# EAGLE schematic Shield_x (EAGLE 9.6.0)
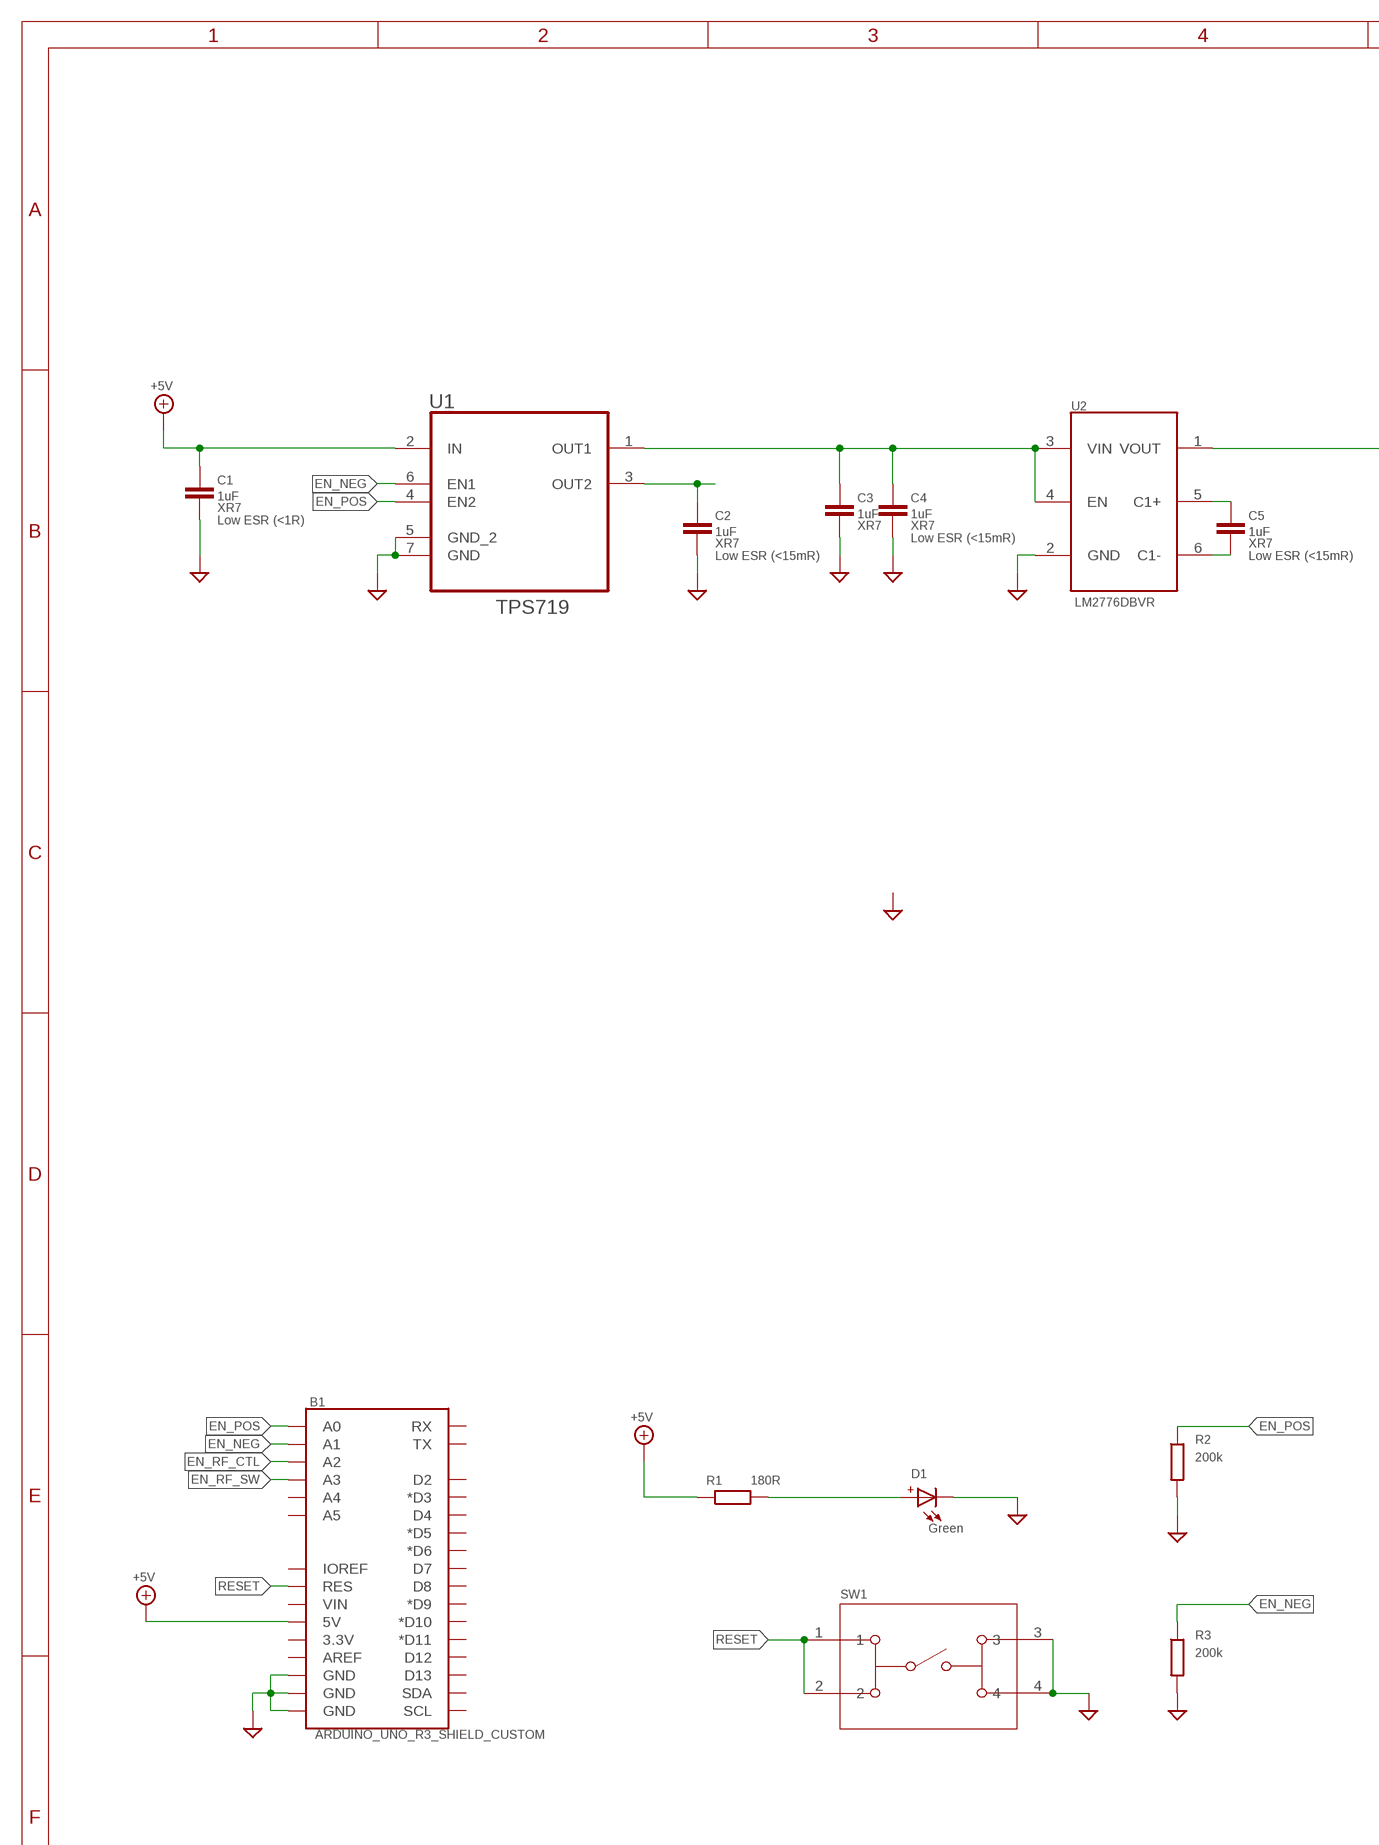
[diagram p0: schematic, sheet 1, part 1 of 2]
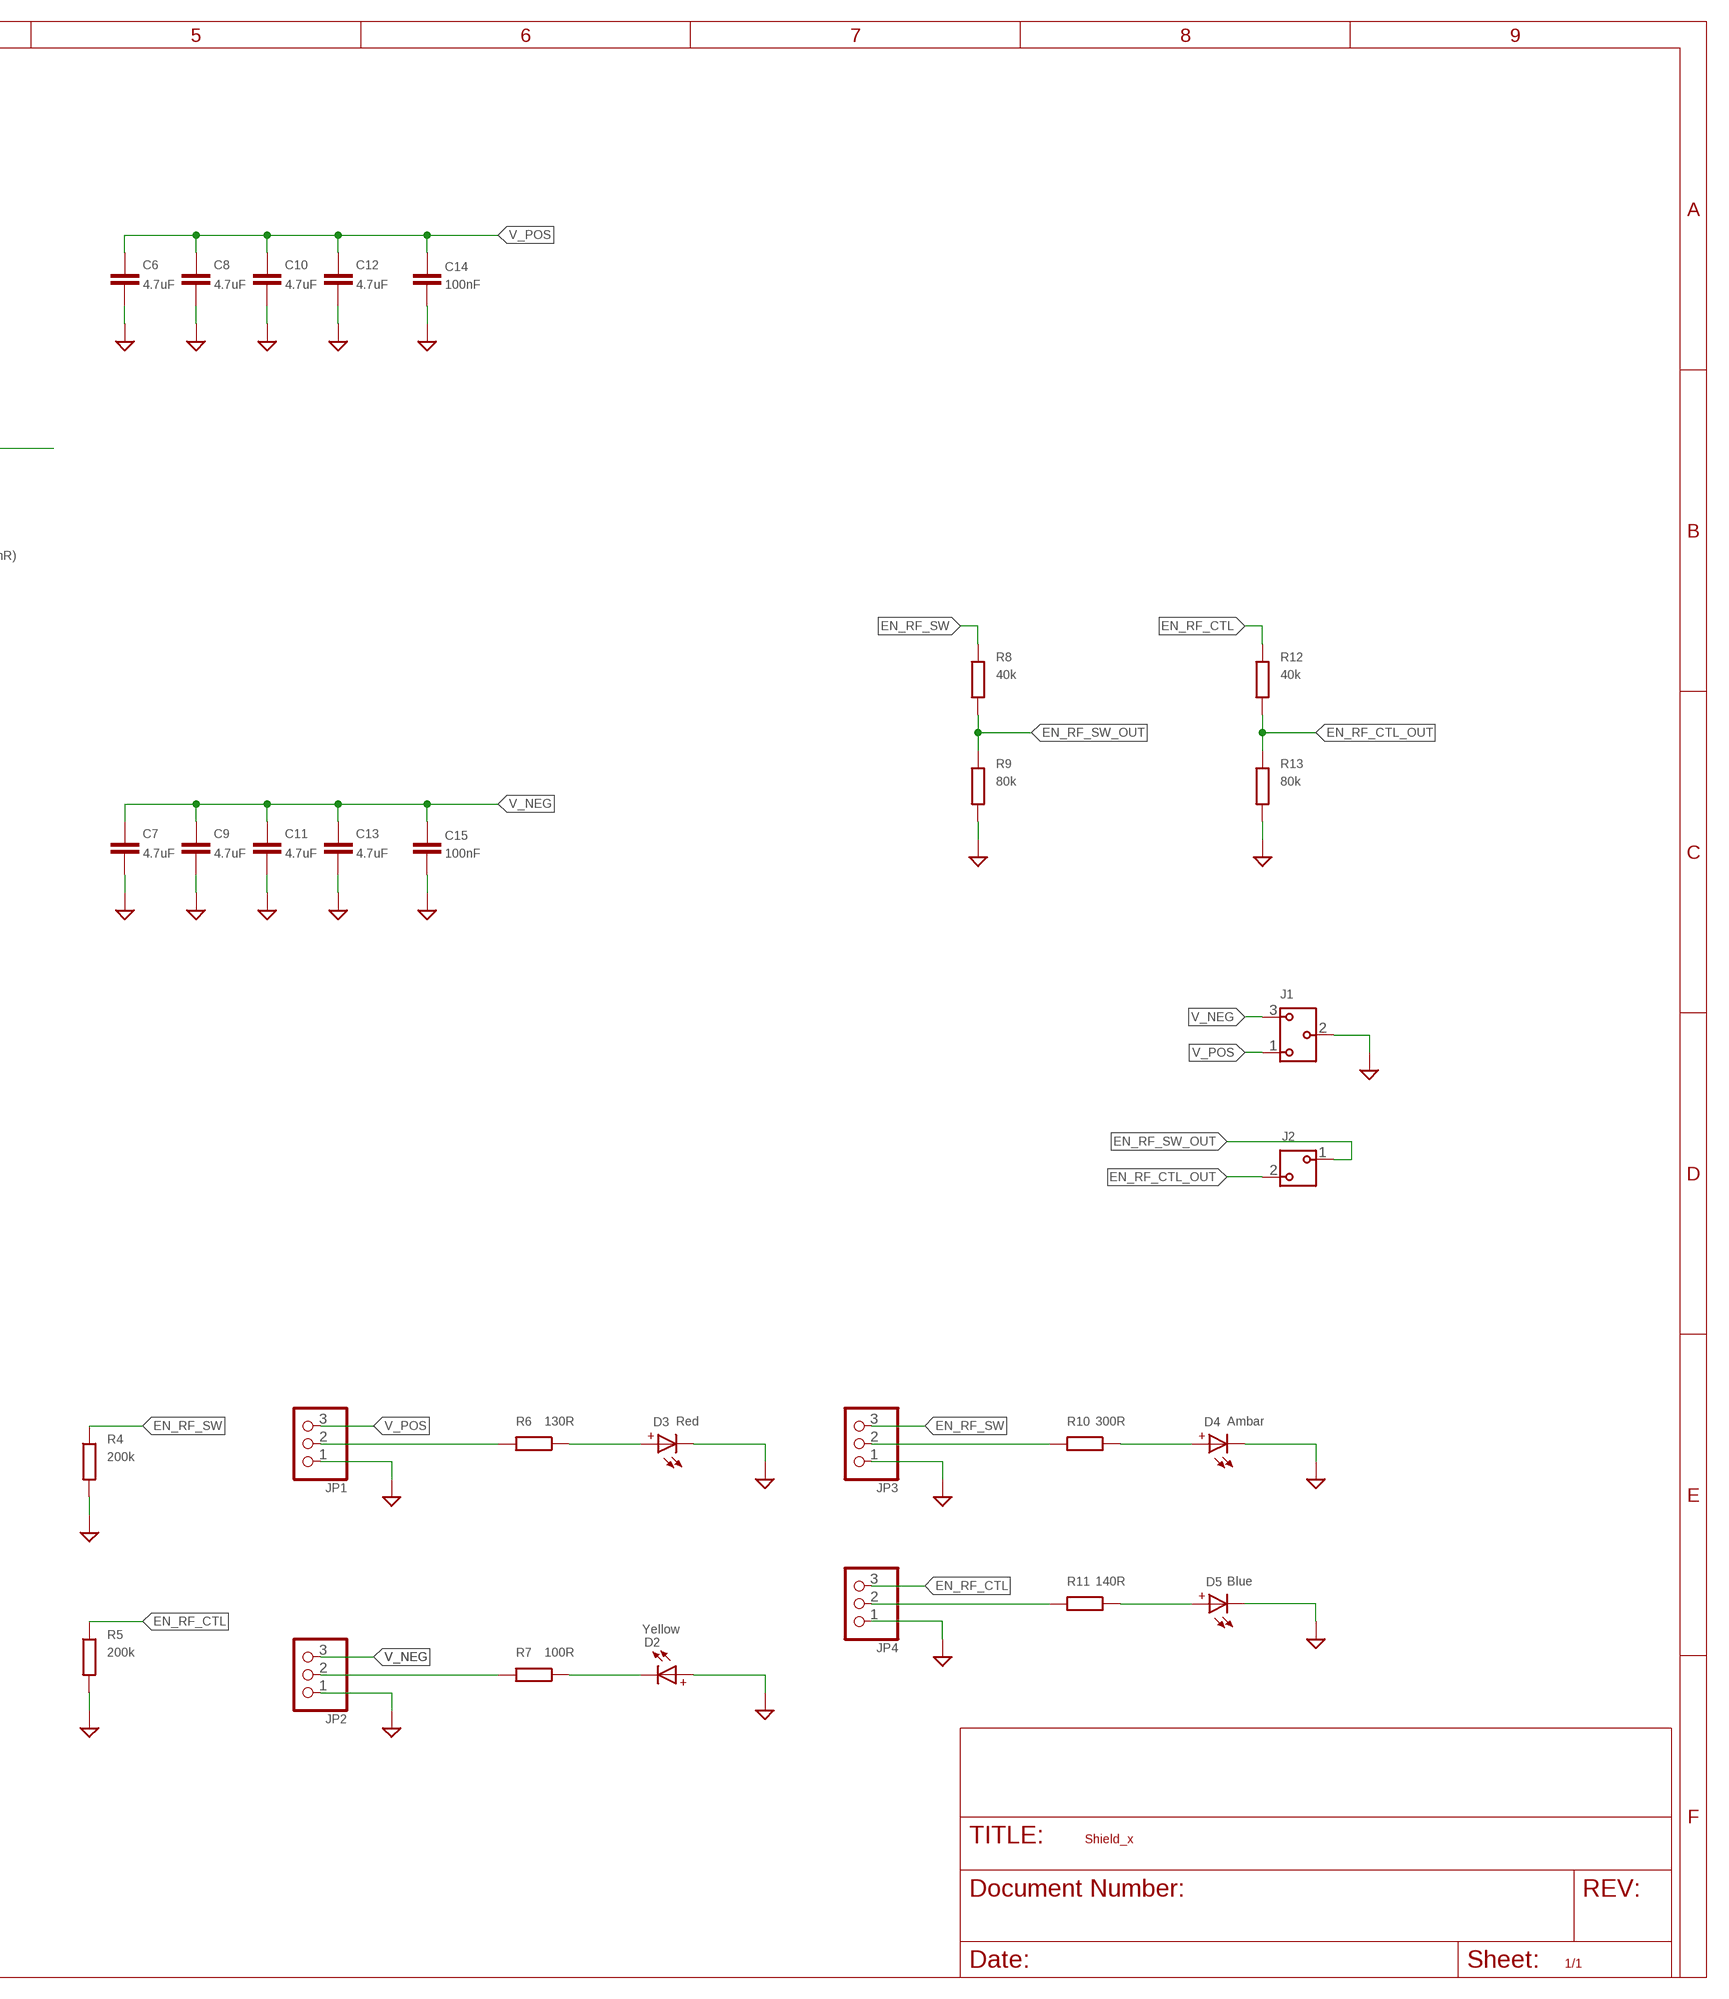
[diagram p1: schematic, sheet 1, part 2 of 2]

## Parts
B1  ARDUINO_UNO_R3_SHIELD_CUSTOM  [UNO_R3_SHIELD_NO_PROG]
C1  1uF  C-EUC0402  [C0402]
C2  1uF  C-EUC0402  [C0402]
C3  1uF  C-EUC0402  [C0402]
C4  1uF  C-EUC0402  [C0402]
C5  1uF  C-EUC0402  [C0402]
C6  4.7uF  C-EUC1206  [C1206]
C7  4.7uF  C-EUC1206  [C1206]
C8  4.7uF  C-EUC1206  [C1206]
C9  4.7uF  C-EUC1206  [C1206]
C10  4.7uF  C-EUC1206  [C1206]
C11  4.7uF  C-EUC1206  [C1206]
C12  4.7uF  C-EUC1206  [C1206]
C13  4.7uF  C-EUC1206  [C1206]
C14  100nF  C-EUC0603  [C0603]
C15  100nF  C-EUC0603  [C0603]
D1  WL-SMCW-150080GS75000  [WL-SMCW_0805]
D2  WL-SMCW-150080YS75000  [WL-SMCW_0805]
D3  WL-SMCW-150080RS75000  [WL-SMCW_0805]
D4  WL-SMCW_150080AS75000  [WL-SMCW_0805]
D5  WL-SMCW-150080BS75000  [WL-SMCW_0805]
J1  691412320003  [691412320003]
J2  691412320002  [691412320002]
JP1  PINHD-1X3  [1X03]
JP2  PINHD-1X3  [1X03]
JP3  PINHD-1X3  [1X03]
JP4  PINHD-1X3  [1X03]
R1  180R  R-EU_R0603  [R0603]
R2  200k  R-EU_R0603  [R0603]
R3  200k  R-EU_R0603  [R0603]
R4  200k  R-EU_R0603  [R0603]
R5  200k  R-EU_R0603  [R0603]
R6  130R  R-EU_R0603  [R0603]
R7  100R  R-EU_R0603  [R0603]
R8  40k  R-EU_R0603  [R0603]
R9  80k  R-EU_R0603  [R0603]
R10  300R  R-EU_R0603  [R0603]
R11  140R  R-EU_R0603  [R0603]
R12  40k  R-EU_R0603  [R0603]
R13  80k  R-EU_R0603  [R0603]
SW1  1825910-6  [SW4_1825910-B]
U1  TPS719  [SON6_5P200X200X80-7N]
U2  LM2776DBVR  [TEXAS_SOT23-6]

## Nets
+5V: B1.5V C1.1 R1.1 U1.2(IN)
EN_NEG: B1.A1 R3.1 U1.6(EN1)
EN_POS: B1.A0 R2.1 U1.4(EN2)
EN_RF_CTL: B1.A2 JP4.3 R5.1 R12.1
EN_RF_CTL_OUT: J2.2 R12.2 R13.1
EN_RF_SW: B1.A3 JP3.3 R4.1 R8.1
EN_RF_SW_OUT: J2.1 R8.2 R9.1
GND: B1.GND@0(GND) B1.GND@1(GND) B1.GND@2(GND) C1.2 C2.2 C3.2 C4.2 C6.2 C7.2 C8.2 C9.2 C10.2 C11.2 C12.2 C13.2 C14.2 C15.2 D1.1(-) D2.2(+) D3.1(-) D4.1(-) D5.1(-) J1.2 JP1.1 JP2.1 JP3.1 JP4.1 R2.2 R3.2 R4.2 R5.2 R9.2 R13.2 SW1.3 SW1.4 U1.5(GND_2) U1.7(GND) U2.2(GND)
N$1: C2.1 U1.3(OUT2)
N$2: D1.2(+) R1.2
N$4: C5.1 U2.5(C1+)
N$6: C5.2 U2.6(C1-)
N$17: D3.2(+) R6.1
N$18: D2.1(-) R7.1
N$19: JP1.2 R6.2
N$20: JP2.2 R7.2
N$21: D4.2(+) R10.1
N$22: D5.2(+) R11.1
N$23: JP3.2 R10.2
N$24: JP4.2 R11.2
N$26: C3.1 C4.1 U1.1(OUT1) U2.3(VIN) U2.4(EN)
N$27: U2.1(VOUT)
RESET: B1.RES SW1.1 SW1.2
V_NEG: C7.1 C9.1 C11.1 C13.1 C15.1 J1.3 JP2.3
V_POS: C6.1 C8.1 C10.1 C12.1 C14.1 J1.1 JP1.3
Unconnected: B1.3.3V B1.A4 B1.A5 B1.AREF B1.D2 B1.D3(*D3) B1.D4 B1.D5(*D5) B1.D6(*D6) B1.D7 B1.D8 B1.D9(*D9) B1.D10(*D10) B1.D11(*D11) B1.D12 B1.D13 B1.IOREF B1.RX B1.SCL B1.SDA B1.TX B1.VIN

## Library data of the parts
B1 = mmTag_PowerSupply:ARDUINO_UNO_R3_SHIELD_CUSTOM: Arduino R3 Shield Footprint Shield form compatible with the Arduino Uno R3. SparkFun Products: MG2639 Cellular Shield <https://www.sparkfun.com/products/13120> MIDI Shield <https://www.sparkfun.com/products/12898> R3 Stackable Headers Kit <https://www.sparkfun.com/products/11417>
C1 = resistor:C-EU: CAPACITOR, European symbol; ESR: Low ESR (<1R); TYPE: XR7
C2-C5 = resistor:C-EU: CAPACITOR, European symbol; ESR: Low ESR (<15mR); TYPE: XR7
C6-C15 = resistor:C-EU: CAPACITOR, European symbol
D1 = Wurth_Elektronik_Optoelectronics_rev19b:WL-SMCW: SMD mono-color Chip LED Characteristics Low energy consumption High reliability Low current requirement Fast switching No UV/IR radiation Smallest SMD package with exceptional brightness Top view Wide viewing angle PBC high-usage Applications Backlight for mobile and portable device keypads Indoor and outdoor message boards Flat backlight for LCDs, switches and symbols Display for industrial control systems and traffic Miniaturized color effects Pedestrian mark Optical indicators General lighting Toys <http://katalog.we-online.de/media/images/v2/Family_WL-SMCW.jpg> Details see: http://katalog.we-online.de/en/led/WL-SMCW?m Updated 2015-04-10 2015 (C) Wurth Elektronik; COLOR: Green
D2 = Wurth_Elektronik_Optoelectronics_rev19b:WL-SMCW: SMD mono-color Chip LED Characteristics Low energy consumption High reliability Low current requirement Fast switching No UV/IR radiation Smallest SMD package with exceptional brightness Top view Wide viewing angle PBC high-usage Applications Backlight for mobile and portable device keypads Indoor and outdoor message boards Flat backlight for LCDs, switches and symbols Display for industrial control systems and traffic Miniaturized color effects Pedestrian mark Optical indicators General lighting Toys <http://katalog.we-online.de/media/images/v2/Family_WL-SMCW.jpg> Details see: http://katalog.we-online.de/en/led/WL-SMCW?m Updated 2015-04-10 2015 (C) Wurth Elektronik; COLOR: Yellow
D3 = Wurth_Elektronik_Optoelectronics_rev19b:WL-SMCW: SMD mono-color Chip LED Characteristics Low energy consumption High reliability Low current requirement Fast switching No UV/IR radiation Smallest SMD package with exceptional brightness Top view Wide viewing angle PBC high-usage Applications Backlight for mobile and portable device keypads Indoor and outdoor message boards Flat backlight for LCDs, switches and symbols Display for industrial control systems and traffic Miniaturized color effects Pedestrian mark Optical indicators General lighting Toys <http://katalog.we-online.de/media/images/v2/Family_WL-SMCW.jpg> Details see: http://katalog.we-online.de/en/led/WL-SMCW?m Updated 2015-04-10 2015 (C) Wurth Elektronik; COLOR: Red
D4 = Wurth_Elektronik_Optoelectronics_rev19b:WL-SMCW: SMD mono-color Chip LED Characteristics Low energy consumption High reliability Low current requirement Fast switching No UV/IR radiation Smallest SMD package with exceptional brightness Top view Wide viewing angle PBC high-usage Applications Backlight for mobile and portable device keypads Indoor and outdoor message boards Flat backlight for LCDs, switches and symbols Display for industrial control systems and traffic Miniaturized color effects Pedestrian mark Optical indicators General lighting Toys <http://katalog.we-online.de/media/images/v2/Family_WL-SMCW.jpg> Details see: http://katalog.we-online.de/en/led/WL-SMCW?m Updated 2015-04-10 2015 (C) Wurth Elektronik; COLOR: Ambar
D5 = Wurth_Elektronik_Optoelectronics_rev19b:WL-SMCW: SMD mono-color Chip LED Characteristics Low energy consumption High reliability Low current requirement Fast switching No UV/IR radiation Smallest SMD package with exceptional brightness Top view Wide viewing angle PBC high-usage Applications Backlight for mobile and portable device keypads Indoor and outdoor message boards Flat backlight for LCDs, switches and symbols Display for industrial control systems and traffic Miniaturized color effects Pedestrian mark Optical indicators General lighting Toys <http://katalog.we-online.de/media/images/v2/Family_WL-SMCW.jpg> Details see: http://katalog.we-online.de/en/led/WL-SMCW?m Updated 2015-04-10 2015 (C) Wurth Elektronik; COLOR: Blue
J1 = Wurth_Connectors_WR-TBL Spring Clamp:691412320003: WR-TBL Serie 4123 - 3.81 mm Screwless 45° Entry KIND PROPERTIES Pitch 3.81 mm MATERIAL PROPERTIES Insulator Material PA6/66 Insulator Flammability Rating UL94 V-0 Insulator Color Grey Contact Material Phosphor Bronze Contact Plating Matte Tin Wire Guard Material Phosphor Bronze GENERAL INFORMATION Operating Temperature -30 up to +120 °C Compliance Lead free / RoHS ELECTRICAL PROPERTIES IR UL 4 A IR VDE 4 A Working Voltage [UL] 300 V (AC) Working Voltage [VDE] 450 V (AC) Withstanding Voltage [UL] 1600 V (AC) Withstanding Voltage [VDE] 2500 V (AC) Contact Resistance 20 mΩ Mechanical Properties Wire Strip Length 7 (mm) Wire Properties Solid Wire Section (AWG) 16 to 30 (AWG) Solid Wire Section (Metric) 1.31 to 0.0509 (mm²) Stranded Wire Section (AWG) 16 to 30 (AWG) Stranded Wire Section (Metric) 1.31 to 0.0509 (mm²) CERTIFICATION UL Approval E150931 VDE Approval 40013441 Packaging Properties Packaging Box <https://www.we-online.com/catalog/media/o84303v209%20Family_WR-TBL4_6914123200xx.jpg> Details see: https://www.we-online.com/catalog/en/TBL_3_81_4123_SCREWLESS_45-DEGREE_ENTRY_6914123200xx/ Updated by Ella Wu 2019-12-31 2019(C) Wurth Elektronik; DATASHEET-URL: https://www.we-online.com/catalog/datasheet/691412320003.pdf; IR-UL: 4A; IR-VDE: 4A; MOUNT: THT; PART-NUMBER: 691412320003; PINS: 3; PITCH: 3.81mm; TYPE: 45°; WIRE: 16 to 30 (AWG) 1.31 to 0.05 (mm²); WORKING-VOLTAGE-UL: 300V (AC); WORKING-VOLTAGE-VDE: 450V (AC)
J2 = Wurth_Connectors_WR-TBL Spring Clamp:691412320002: WR-TBL Serie 4123 - 3.81 mm Screwless 45° Entry KIND PROPERTIES Pitch 3.81 mm MATERIAL PROPERTIES Insulator Material PA6/66 Insulator Flammability Rating UL94 V-0 Insulator Color Grey Contact Material Phosphor Bronze Contact Plating Matte Tin Wire Guard Material Phosphor Bronze GENERAL INFORMATION Operating Temperature -30 up to +120 °C Compliance Lead free / RoHS ELECTRICAL PROPERTIES IR UL 4 A IR VDE 4 A Working Voltage [UL] 300 V (AC) Working Voltage [VDE] 450 V (AC) Withstanding Voltage [UL] 1600 V (AC) Withstanding Voltage [VDE] 2500 V (AC) Contact Resistance 20 mΩ Mechanical Properties Wire Strip Length 7 (mm) Wire Properties Solid Wire Section (AWG) 16 to 30 (AWG) Solid Wire Section (Metric) 1.31 to 0.0509 (mm²) Stranded Wire Section (AWG) 16 to 30 (AWG) Stranded Wire Section (Metric) 1.31 to 0.0509 (mm²) CERTIFICATION UL Approval E150931 VDE Approval 40013441 Packaging Properties Packaging Box <https://www.we-online.com/catalog/media/o84303v209%20Family_WR-TBL4_6914123200xx.jpg> Details see: https://www.we-online.com/catalog/en/TBL_3_81_4123_SCREWLESS_45-DEGREE_ENTRY_6914123200xx/ Updated by Ella Wu 2019-12-31 2019(C) Wurth Elektronik; DATASHEET-URL: https://www.we-online.com/catalog/datasheet/691412320002.pdf; IR-UL: 4A; IR-VDE: 4A; MOUNT: THT; PART-NUMBER: 691412320002; PINS: 2; PITCH: 3.81mm; TYPE: 45°; WIRE: 16 to 30 (AWG) 1.31 to 0.05 (mm²); WORKING-VOLTAGE-UL: 300V (AC); WORKING-VOLTAGE-VDE: 450V (AC)
JP1-JP4 = pinhead:PINHD-1X3: PIN HEADER
R1-R13 = resistor:R-EU_: RESISTOR, European symbol
SW1 = Switches:1825910-6; BUILT_BY: EMA_UL_Team; CATEGORY: Tactile Switches; CONFIGURATION__POLE-THROW_: Single Pole - Single Throw; COPYRIGHT: Copyright (C) 2016 Accelerated Designs. All rights reserved; DESCRIPTION: FSM4JH=6MM TACT SWITCH, HIGH TEMP; MANUFACTURER_PART_NUMBER: 1825910-6; MAX_SWITCHING_CURRENT: -; MAX_SWITCHING_VOLTAGE_AC_: -; PART_STATUS: active; PRODUCT_TYPE: Switch; SERIES: ?Alcoswitch FSM; SWITCH_TYPE: Tactile Switches; TE_PART_NUMBER: 1825910-6; VENDOR: TE Connectivity
U1 = mmTag_PowerSupply:TPS719: Low-Dropout Linear Regulators; DESCRIPTION: Dual 200mA Output, Low Noise, High PSRR, Low Dropout, Linear Regulator 6-WSON -40 to 125; MF: Texas Instruments; PACKAGE: SON-6 Texas Instruments
U2 = mmTag_PowerSupply:LM2776: Switched Capacitor Inverter

## Net classes
0 default: width 0.203 mm, drill 0.305 mm, clearance 0.152 mm
3 usbvcc: width 0.203 mm, drill 0.305 mm, clearance 0.203 mm